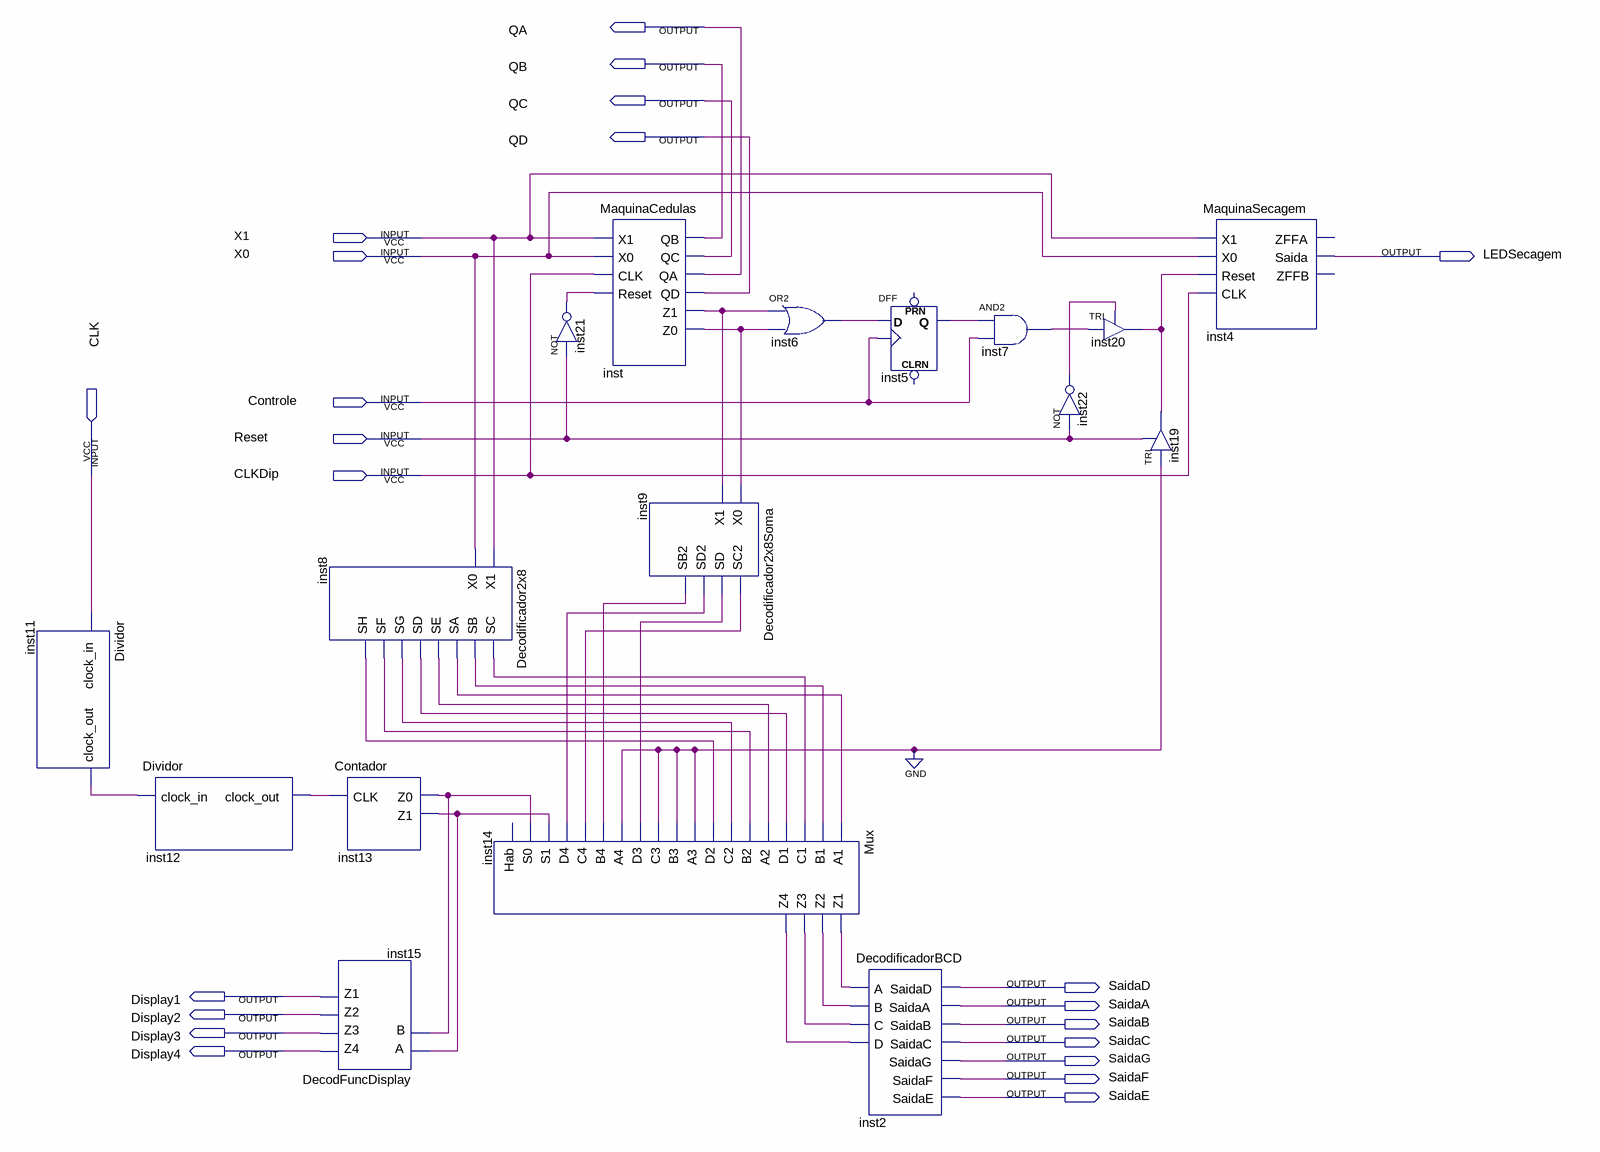
[diagram p0: schematic sheet]
// Quartus schematic pbl03.bdf as structural Verilog: 17 symbols, 22 pins
module pbl03 (
  input  X1,
  input  X0,
  input  Controle,
  input  Reset,
  input  CLK,
  input  CLKDip,
  output QA,
  output QB,
  output QC,
  output QD,
  output LEDSecagem,
  output SaidaD,
  output Display1,
  output SaidaA,
  output Display2,
  output SaidaB,
  output Display3,
  output SaidaC,
  output Display4,
  output SaidaG,
  output SaidaF,
  output SaidaE
);

  wire inst5_q, inst6_out, inst7_out, inst8_sa, inst8_sb, inst8_sc, inst8_sd, inst8_se, inst8_sf, inst8_sg,
       inst8_sh, inst9_sb2, inst9_sc2, inst9_sd, inst9_sd2, inst11_clock_out, inst12_clock_out, inst13_z0,
       inst13_z1, inst14_z1, inst14_z2, inst14_z3, inst14_z4, inst20_out, inst21_out, inst22_out, inst_z0,
       inst_z1;

  Dividor inst11 (.clock_in(CLK), .clock_out(inst11_clock_out));
  Dividor inst12 (.clock_in(inst11_clock_out), .clock_out(inst12_clock_out));
  Decodificador2x8 inst8 (
    .X1(X1), .X0(X0), .SC(inst8_sc), .SB(inst8_sb), .SA(inst8_sa), .SE(inst8_se), .SD(inst8_sd),
    .SG(inst8_sg), .SF(inst8_sf), .SH(inst8_sh));
  Contador inst13 (.CLK(inst12_clock_out), .Z0(inst13_z0), .Z1(inst13_z1));
  DecodFuncDisplay inst15 (.A(inst13_z1), .B(inst13_z0), .Z4(Display4), .Z3(Display3), .Z2(Display2), .Z1(Display1));
  Mux inst14 (
    .A1(inst8_sa), .B1(inst8_sb), .C1(inst8_sc), .D1(inst8_sd), .A2(inst8_se), .B2(inst8_sf), .C2(inst8_sg),
    .D2(inst8_sh), .A3(1'b0), .B3(1'b0), .C3(1'b0), .D3(inst9_sd), .A4(1'b0), .B4(inst9_sb2), .C4(inst9_sc2),
    .D4(inst9_sd2), .S1(inst13_z1), .S0(inst13_z0), .Z1(inst14_z1), .Z2(inst14_z2), .Z3(inst14_z3),
    .Z4(inst14_z4));  // open: Hab
  not inst21 (inst21_out, Reset);
  MaquinaCedulas inst (
    .X1(X1), .X0(X0), .CLK(CLKDip), .Reset(inst21_out), .QB(QB), .QC(QC), .QA(QA), .QD(QD), .Z1(inst_z1),
    .Z0(inst_z0));
  Decodificador2x8Soma inst9 (
    .X0(inst_z0), .X1(inst_z1), .SC2(inst9_sc2), .SD(inst9_sd), .SD2(inst9_sd2), .SB2(inst9_sb2));
  or inst6 (inst6_out, inst_z1, inst_z0);
  DFF inst5 (.CLK(Controle), .D(inst6_out), .Q(inst5_q));  // open: CLRN, PRN
  DecodificadorBCD inst2 (
    .A(inst14_z1), .B(inst14_z2), .C(inst14_z3), .D(inst14_z4), .SaidaD(SaidaD), .SaidaA(SaidaA),
    .SaidaB(SaidaB), .SaidaC(SaidaC), .SaidaG(SaidaG), .SaidaF(SaidaF), .SaidaE(SaidaE));
  and inst7 (inst7_out, inst5_q, Controle);
  TRI inst20 (.IN(inst7_out), .OE(inst22_out), .OUT(inst20_out));
  not inst22 (inst22_out, Reset);
  TRI inst19 (.IN(1'b0), .OE(Reset), .OUT(inst20_out));
  MaquinaSecagem inst4 (.X1(X1), .X0(X0), .Reset(inst20_out), .CLK(CLKDip), .Saida(LEDSecagem));  // open: ZFFA, ZFFB
endmodule
